# EAGLE design arduino_wireless_shield_rev_1_0 (EAGLE 6.3)
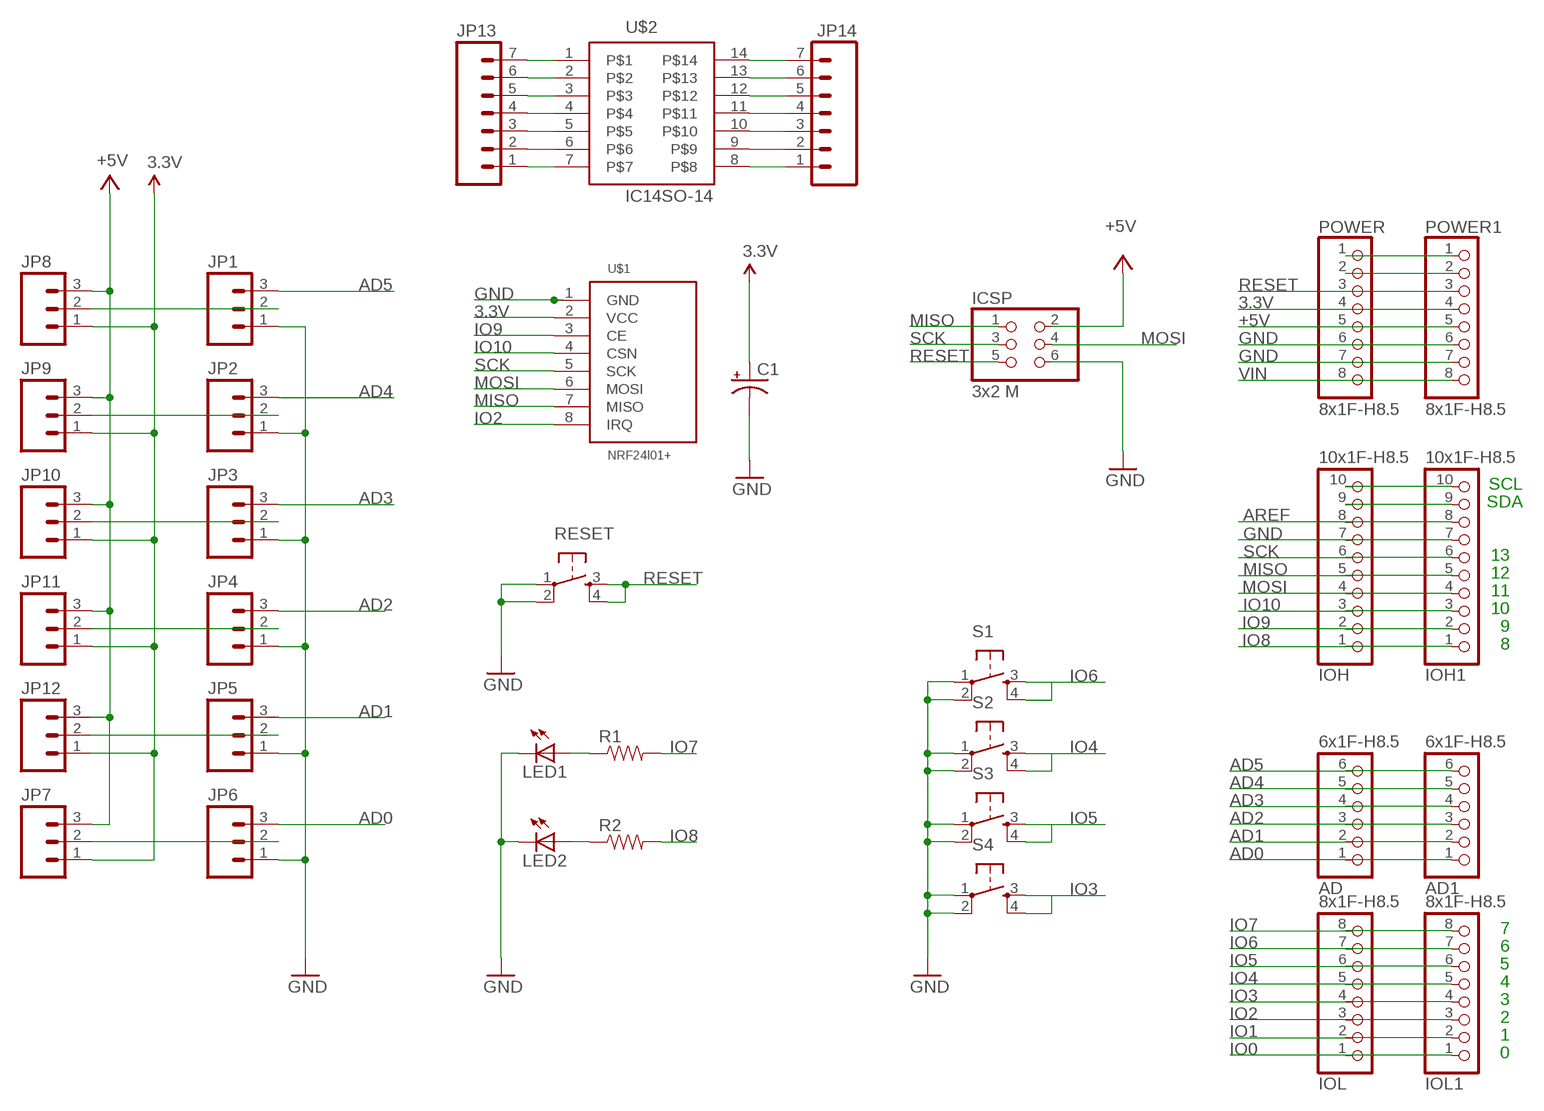
[diagram p0: schematic, sheet 1]

## Parts
AD  6x1F-H8.5  PINHD-1X6  [1X06]
AD1  6x1F-H8.5  PINHD-1X6  [1X06]
C1  CPOL-USTT2D7  [TT2D7]
ICSP  3x2 M  PINHD-2X3  [2X03]
IOH  10x1F-H8.5  PINHD-1X10_ARD  [1X10]
IOH1  10x1F-H8.5  PINHD-1X10_ARD  [1X10]
IOL  8x1F-H8.5  PINHD-1X8  [1X08]
IOL1  8x1F-H8.5  PINHD-1X8  [1X08]
JP1  M03PTH  [1X03]
JP2  M03PTH  [1X03]
JP3  M03PTH  [1X03]
JP4  M03PTH  [1X03]
JP5  M03PTH  [1X03]
JP6  M03PTH  [1X03]
JP7  M03PTH  [1X03]
JP8  M03PTH  [1X03]
JP9  M03PTH  [1X03]
JP10  M03PTH  [1X03]
JP11  M03PTH  [1X03]
JP12  M03PTH  [1X03]
JP13  M07  [1X07]
JP14  M07  [1X07]
LED1  LED5MM  [LED5MM]
LED2  LED5MM  [LED5MM]
POWER  8x1F-H8.5  PINHD-1X8  [1X08]
POWER1  8x1F-H8.5  PINHD-1X8  [1X08]
R1  RESISTORPTH-1/4W  [AXIAL-0.4]
R2  RESISTORPTH-1/4W  [AXIAL-0.4]
RESET  TAC_SWITCHPTH  [TACTILE-PTH]
S1  TAC_SWITCHPTH  [TACTILE-PTH]
S2  TAC_SWITCHPTH  [TACTILE-PTH]
S3  TAC_SWITCHPTH  [TACTILE-PTH]
S4  TAC_SWITCHPTH  [TACTILE-PTH]
U$1  NRF24L01+_MODULE  [NRF24L01+MODULE]
U$2  IC14SO-14  [SO14]

## Nets
3.3V [power]: C1.+ JP7.1 JP8.1 JP9.1 JP10.1 JP11.1 JP12.1 POWER1.4 POWER.4 U$1.2(VCC)
+5V [usbvcc]: ICSP.2 JP7.3 JP8.3 JP9.3 JP10.3 JP11.3 JP12.3 POWER1.5 POWER.5
AD0: AD1.1 AD.1 JP6.3
AD1: AD1.2 AD.2 JP5.3
AD2: AD1.3 AD.3 JP4.3
AD3: AD1.4 AD.4 JP3.3
AD4: AD1.5 AD.5 JP2.3
AD5: AD1.6 AD.6 JP1.3
AREF [aref]: IOH1.8 IOH.8
GND [gnd]: C1.- ICSP.6 IOH1.7 IOH.7 JP1.1 JP2.1 JP3.1 JP4.1 JP5.1 JP6.1 LED1.K(C) LED2.K(C) POWER1.6 POWER1.7 POWER.6 POWER.7 RESET.1 RESET.2 S1.1 S1.2 S2.1 S2.2 S3.1 S3.2 S4.1 S4.2 U$1.1(GND)
IO0: IOL1.1 IOL.1
IO1: IOL1.2 IOL.2
IO2: IOL1.3 IOL.3 U$1.8(IRQ)
IO3: IOL1.4 IOL.4 S4.3 S4.4
IO4: IOL1.5 IOL.5 S2.3 S2.4
IO5: IOL1.6 IOL.6 S3.3 S3.4
IO6: IOL1.7 IOL.7 S1.3 S1.4
IO7: IOL1.8 IOL.8 R1.P$2
IO8: IOH1.1 IOH.1 R2.P$2
IO9: IOH1.2 IOH.2 U$1.3(CE)
IO10: IOH1.3 IOH.3 U$1.4(CSN)
MISO: ICSP.1 IOH1.5 IOH.5 U$1.7(MISO)
MOSI: ICSP.4 IOH1.4 IOH.4 U$1.6(MOSI)
N$1: POWER1.1 POWER.1
N$2: POWER1.2 POWER.2
N$3: JP13.7 U$2.1
N$4: JP6.2 JP7.2
N$5: LED2.A R2.P$1
N$6: LED1.A R1.P$1
N$7: IOH1.10 IOH.10
N$8: IOH1.9 IOH.9
N$9: JP13.6 U$2.2
N$10: JP5.2 JP12.2
N$11: JP4.2 JP11.2
N$12: JP3.2 JP10.2
N$13: JP2.2 JP9.2
N$14: JP1.2 JP8.2
N$15: JP13.5 U$2.3
N$16: JP13.4 U$2.4
N$17: JP13.3 U$2.5
N$18: JP13.2 U$2.6
N$19: JP13.1 U$2.7
N$20: JP14.7 U$2.14
N$21: JP14.6 U$2.13
N$22: JP14.5 U$2.12
N$23: JP14.4 U$2.11
N$24: JP14.3 U$2.10
N$25: JP14.2 U$2.9
N$26: JP14.1 U$2.8
RESET: ICSP.5 POWER1.3 POWER.3 RESET.3 RESET.4
SCK: ICSP.3 IOH1.6 IOH.6 U$1.5(SCK)
VIN [power]: POWER1.8 POWER.8

## Notes on the sheet
- SCL
- SDA
- 13
- 12
- 11
- 10
- 9
- 8
- 7
- 6
- 5
- 4
- 3
- 2
- 1
- 0

## Library data of the parts
AD AD1 = SmartPrj:PINHD-1X6: PIN HEADER
C1 = rcl:CPOL-US: POLARIZED CAPACITOR, American symbol
ICSP = SmartPrj:PINHD-2X3: PIN HEADER
IOH IOH1 = SmartPrj:PINHD-1X10_ARD: PIN HEADER
IOL IOL1 POWER POWER1 = SmartPrj:PINHD-1X8: PIN HEADER
JP1-JP12 = SparkFun-Connectors:M03: Header 3 Standard 3-pin 0.1" header. Use with straight break away headers (SKU : PRT-00116), right angle break away headers (PRT-00553), swiss pins (PRT-00743), machine pins (PRT-00117), and female headers (PRT-00115). Molex polarized connector foot print use with SKU : PRT-08232 with associated crimp pins and housings.
JP13 JP14 = SparkFun-Connectors:M07: Header 7 Standard 7-pin 0.1" header. Use with straight break away headers (SKU : PRT-00116), right angle break away headers (PRT-00553), swiss pins (PRT-00743), machine pins (PRT-00117), and female headers (PRT-00115). NOTES ON THE VARIANTS LOCK and LOCK_LONGPADS... This footprint was designed to help hold the alignment of a through-hole component (i.e. 7-pin header) while soldering it into place. You may notice that each hole has been shifted either up or down by 0.005 of an inch from it's more standard position (which is usually a perfectly straight line). This slight alteration caused the pins (the squares in the middle) to touch the edges of the holes. Because they are alternating, it causes a "brace" to hold the header in place. 0.005 has proven to be the perfect amount of "off-center" position when using our standard breakaway headers. Although looks a little odd when you look at the bare footprint, once you have a header in there, the alteration is very hard to notice. Also, if you push a header all the way into place, it is covered up entirely on the bottom side. This idea of altering the position of holes to aid alignment will be further integrated into the Sparkfun Library for other footprints. It can help hold any component with 3 or more connection pins.
LED1 LED2 = SparkFun-LED:LED: LEDs Standard schematic elements and footprints for 5mm, 3mm, 1206, and 0603 sized LEDs. 5mm - Spark Fun Electronics SKU : COM-00529 (and others)
R1 R2 = SparkFun-Resistors:RESISTOR: Resistor Basic schematic elements and footprints for 0603, 1206, and PTH resistors.
RESET S1-S4 = buttons:TAC_SWITCH: Momentary Switch Button commonly used for reset or general input. Spark Fun Electronics SKU : COM-00097 SMT- SWCH-08247
U$1 = nrf24l01:NRF24L01+_MODULE
U$2 = packages:IC14

## Net classes
0 default: width 0.254 mm, clearance 0.254 mm
1 power: width 0.61 mm, drill 0.61 mm, clearance 0.254 mm
2 gnd: width 0.305 mm, drill 0.559 mm, clearance 0.254 mm
3 usbvcc: width 0.508 mm, drill 0.61 mm, clearance 0.254 mm
4 aref: width 0.406 mm, drill 0.61 mm, clearance 0.254 mm

## Board
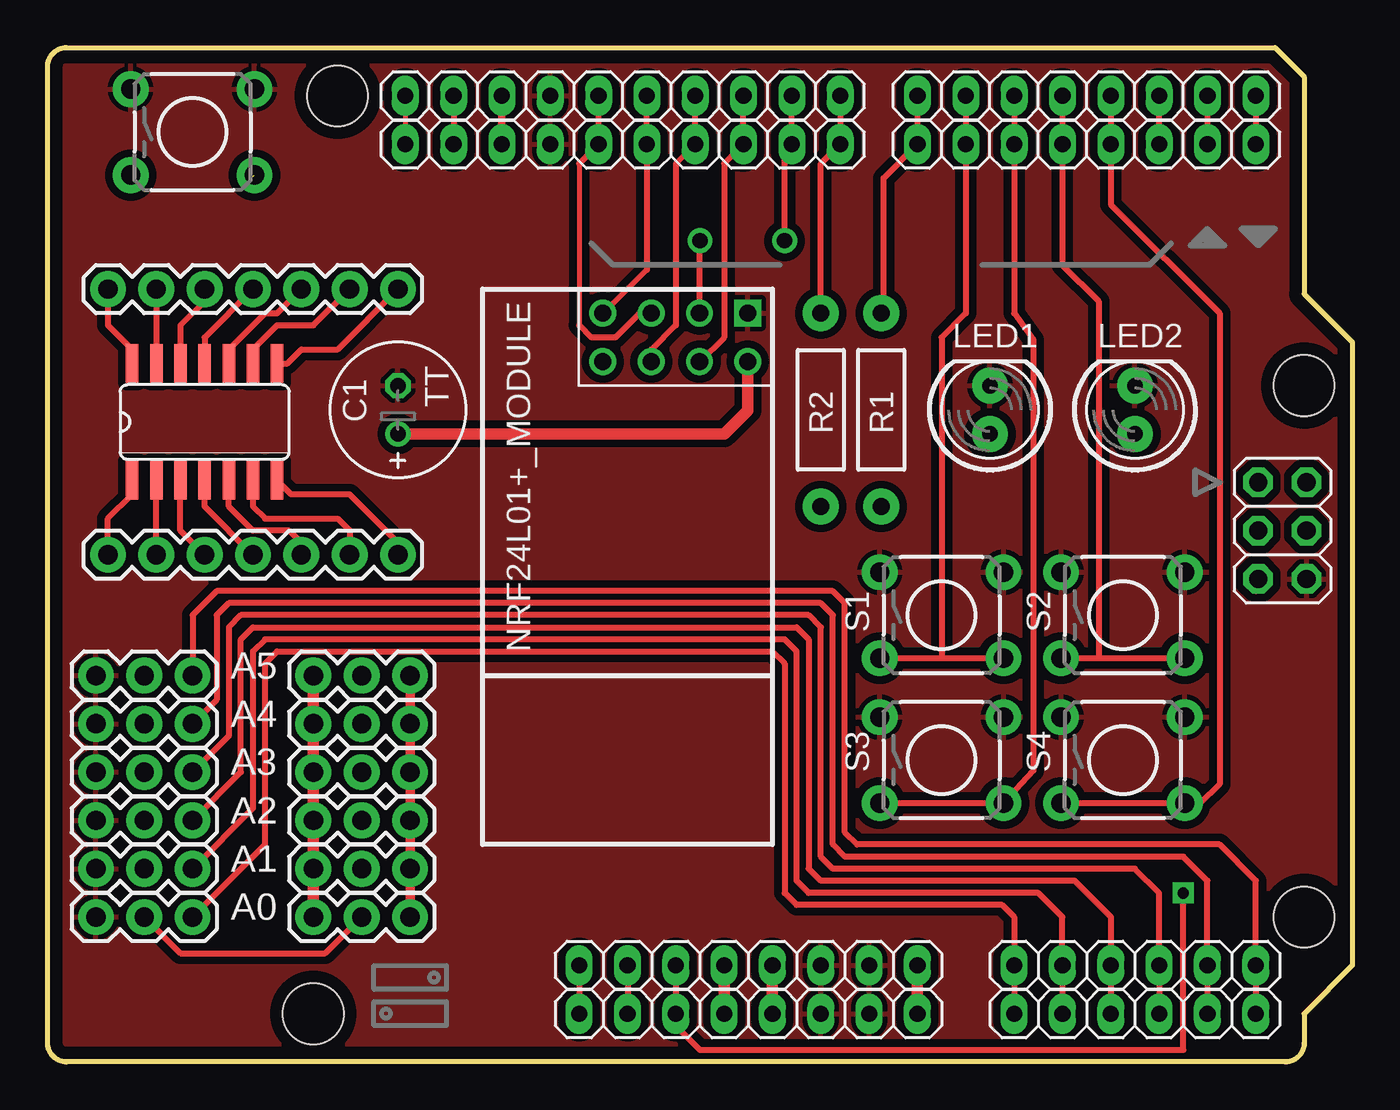
[diagram p1: board, top side]
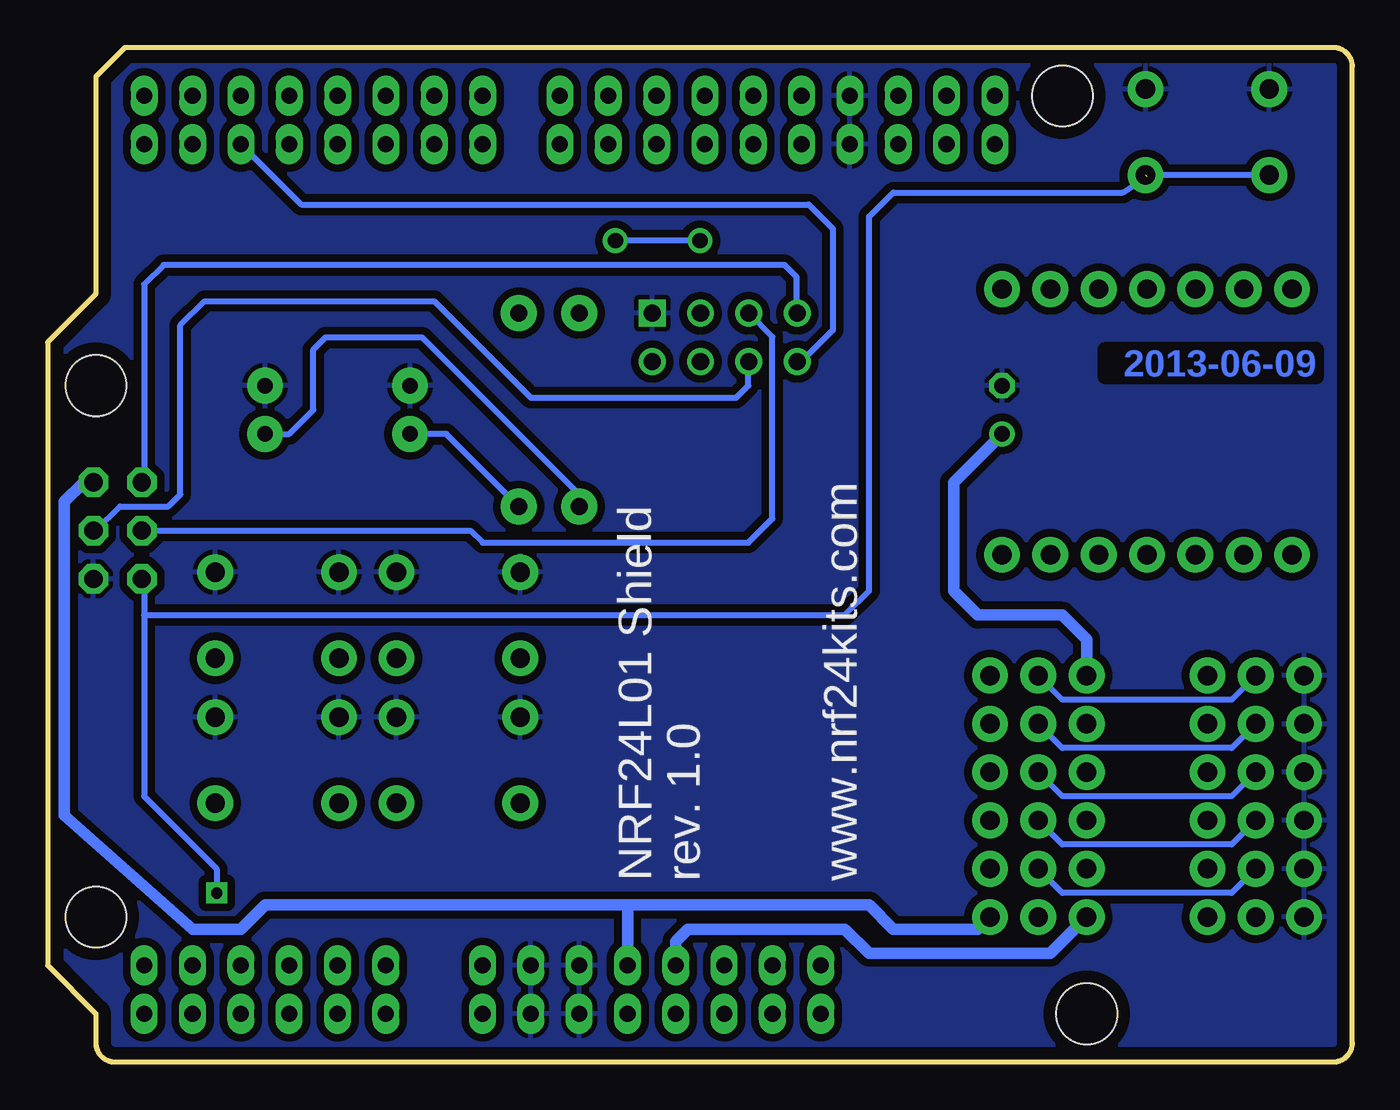
[diagram p2: board, bottom side, seen from below]

Size 68.58 x 53.34 mm. Coordinates in mm from the lower left corner, seen from the top.
Outline: 64.52,53.34 66.04,51.82 66.04,40.39 68.58,37.85 68.58,5.08 66.04,2.54 66.04,1 arc-90 65.04,0 1,0 arc-90 0,1 0,52.34 arc-90 1,53.34 64.52,53.34
Copper layers (1*16): Top 0.035mm / dielectric 1.5mm / Bottom 0.035mm
Design rules "default *": minimum track width 10mil, minimum drill 22mil, track to track 10mil, track to pad 10mil, pad to pad 10mil, via to via 12mil, smd to smd 8mil, copper to edge 26mil, drill to drill 12mil, minimum pad ring 10mil, minimum via ring 10mil, stop-mask expansion 1mil, vias tented up to drill 30mil, thermal gap 10mil
Holes 3.2 mm at 66.04,35.56 66.04,7.62 15.24,50.8 13.97,2.54

### Footprints (pad centres in the part's own frame; a part is rotated, then mirrored left to right if it is on the bottom)
1X06 = drill 0.85 pad 1.422 long: 1 -6.35,0; 2 -3.81,0; 3 -1.27,0; 4 1.27,0; 5 3.81,0; 6 6.35,0
TT2D7 = drill 0.813: + -1.27,0 | drill 0.813 octagon: - 1.27,0
2X03 = drill 0.95 pad 1.55 octagon: 1 -2.54,-1.27; 2 -2.54,1.27; 3 0,-1.27; 4 0,1.27; 5 2.54,-1.27; 6 2.54,1.27
1X10@1 = drill 0.85 pad 1.422 long: 1 -11.43,0; 2 -8.89,0; 3 -6.35,0; 4 -3.81,0; 5 -1.27,0; 6 1.27,0; 7 3.81,0; 8 6.35,0; 9 8.89,0; 10 11.43,0
1X10 = drill 0.85 pad 1.422 long: 1 -11.43,0; 2 -8.89,0; 3 -6.35,0; 4 -3.81,0; 5 -1.27,0; 6 1.27,0; 7 3.81,0; 8 6.35,0; 9 8.89,0; 10 11.43,0
1X08 = drill 0.85 pad 1.422 long: 1 -8.89,0; 2 -6.35,0; 3 -3.81,0; 4 -1.27,0; 5 1.27,0; 6 3.81,0; 7 6.35,0; 8 8.89,0
1X03 = drill 1.016 pad 1.88: 1 0,0; 2 2.54,0; 3 5.08,0
1X07 = drill 1.016 pad 1.88: 1 0,0; 2 2.54,0; 3 5.08,0; 4 7.62,0; 5 10.16,0; 6 12.7,0; 7 15.24,0
LED5MM = drill 0.813 pad 1.88: A -1.27,0; K 1.27,0
AXIAL-0.4 = drill 0.9 pad 1.88: P$1 -5.08,0; P$2 5.08,0
TACTILE-PTH = drill 1.016 pad 1.88: 1 -3.251,2.261; 2 3.251,2.261; 3 -3.251,-2.261; 4 3.251,-2.261
NRF24L01+MODULE = drill 0.9 square: 1 -1.27,3.81 | drill 0.9: 2 1.27,3.81; 3 -1.27,1.27; 4 1.27,1.27; 5 -1.27,-1.27; 6 1.27,-1.27; 7 -1.27,-3.81; 8 1.27,-3.81
SO14 = smd 0.66 x 2.032: 1 -3.81,-3.073; 2 -2.54,-3.073; 3 -1.27,-3.073; 4 0,-3.073; 5 1.27,-3.073; 6 2.54,-3.073; 7 3.81,-3.073; 8 3.81,3.073; 9 2.54,3.073; 10 1.27,3.073; 11 0,3.073; 12 -1.27,3.073; 13 -2.54,3.073; 14 -3.81,3.073

### Placement (x,y rotation side)
AD  57.15,2.54 0 top
AD1  57.15,5.08 0 top
C1  18.41,34.29 90 top
ICSP  64.9,27.94 270 top
IOH  10x1F-H8.5  [1X10@1]  30.23,50.8 180 top
IOH1  30.23,48.26 180 top
IOL  54.61,50.8 180 top
IOL1  54.61,48.26 180 top
JP1  2.54,20.32 0 top
JP2  2.54,17.78 0 top
JP3  2.54,15.24 0 top
JP4  2.54,12.7 0 top
JP5  2.54,10.16 0 top
JP6  2.54,7.62 0 top
JP7  13.97,7.62 0 top
JP8  13.97,20.32 0 top
JP9  13.97,17.78 0 top
JP10  13.97,15.24 0 top
JP11  13.97,12.7 0 top
JP12  13.97,10.16 0 top
JP13  18.41,26.67 180 top
JP14  18.41,40.64 180 top
LED1  49.53,34.29 90 top
LED2  57.15,34.29 90 top
POWER  36.83,2.54 0 top
POWER1  36.83,5.08 0 top
R1  43.81,34.29 90 top
R2  40.64,34.29 90 top
RESET  7.62,48.9 0 top
S1  46.99,23.5 0 top
S2  56.52,23.5 0 top
S3  46.99,15.88 0 top
S4  56.52,15.88 0 top
U$1  32.99,38.1 270 top
U$2  8.26,33.66 0 top

### Tracks (layer width: path | path; a pad name or v marks a point on that pad's centre or on a via)
3.3V
  Top 0.61: JP7.1 JP12.1 JP11.1 JP10.1 JP9.1 JP8.1 | POWER.4 POWER1.4 35.56,5.33 | U$1.2 36.8,34.27 35.56,33.02 C1.+
  Bottom 0.61: JP8.1 13.97,22.23 15.24,23.5 19.68,23.5 20.95,24.77 20.95,30.48 C1.+ | JP7.1 15.88,5.71 25.4,5.71 26.67,6.99 34.92,6.99 35.56,6.35 POWER1.4
+5V
  Top 0.508: JP8.3 JP9.3 JP10.3 JP11.3 JP12.3 JP7.3
  Top 0.61: POWER1.5 POWER.5
  Bottom 0.61: ICSP.2 66.67,30.48 67.69,29.46 67.69,12.95 60.96,6.99 58.42,6.99 57.15,8.26 38.1,8.26 | POWER1.5 38.1,8.26 | 38.1,8.26 25.4,8.26 24.13,6.99 19.68,6.99 JP7.3
AD0
  Top 0.305: AD.1 AD1.1 50.8,7.62 50.16,8.26 39.37,8.26 38.73,8.89 38.73,20.95 38.1,21.59 12.06,21.59 11.43,20.95 11.43,11.43 JP6.3
AD1
  Top 0.305: AD.2 AD1.2 53.34,7.62 52.07,8.89 40.01,8.89 39.37,9.53 39.37,21.59 38.73,22.23 11.43,22.23 10.79,21.59 10.79,13.34 JP5.3
AD2
  Top 0.305: AD.3 AD1.3 55.88,7.62 53.98,9.53 40.64,9.53 40.01,10.16 40.01,22.23 39.37,22.86 10.79,22.86 10.16,22.23 10.16,15.24 JP4.3
AD3
  Top 0.305: AD.4 AD1.4 58.42,8.89 57.15,10.16 41.27,10.16 40.64,10.79 40.64,22.86 40.01,23.5 10.16,23.5 9.53,22.86 9.53,17.14 JP3.3
AD4
  Top 0.305: AD.5 AD1.5 60.96,9.53 59.69,10.79 41.91,10.79 41.27,11.43 41.27,23.5 40.64,24.13 9.53,24.13 8.89,23.5 8.89,19.05 JP2.3
AD5
  Top 0.305: AD.6 AD1.6 63.5,9.53 61.59,11.43 42.55,11.43 41.91,12.06 41.91,24.13 41.27,24.77 8.89,24.77 7.62,23.5 JP1.3
AREF
  Top 0.406: IOH.8 IOH1.8
GND
  pour Bottom (isolate 0.406, rank 2): 0,52.7 67.69,52.7 67.94,52.45 67.94,0.64 0.25,0.64 0,0.89
  pour Top (isolate 0.406, rank 2): 0.51,52.7 67.94,52.7 67.94,0.64 0,0.64 -0.13,30.48
IO0
  Top 0.305: IOL.1 IOL1.1
IO1
  Top 0.305: IOL.2 IOL1.2
IO2
  Top 0.305: IOL1.3 IOL.3
  Bottom 0.254: 28.96,36.83 U$1.8
  Bottom 0.305: 28.96,36.83 27.3,38.48 27.3,43.81 28.57,45.09 55.24,45.09 IOL1.3
IO3
  Top 0.305: IOL.4 IOL1.4 55.88,45.09 61.59,39.37 61.59,14.61 60.6,13.61 S4.4 S4.3
IO4
  Top 0.305: IOL.5 IOL1.5 53.34,41.91 55.24,40.01 55.24,21.23 | S2.3 55.24,21.23 | 55.24,21.23 S2.4
IO5
  Top 0.305: IOL.6 IOL1.6 50.8,39.37 51.82,37.97 51.82,15.32 S3.4 S3.3
IO6
  Top 0.305: IOL.7 IOL1.7 48.26,39.37 46.99,38.1 46.99,21.23 | S1.3 46.99,21.23 | 46.99,21.23 S1.4
IO7
  Top 0.254: 43.94,39.37 R1.P$2
  Top 0.305: IOL.8 IOL1.8 43.94,46.48 43.94,39.37
IO8
  Top 0.305: IOH.1 IOH1.1 40.64,47.24 R2.P$2
IO9  (via drill 0.8)
  Top 0.305: IOH.2 IOH1.2 38.73,47.88 v38.73,43.18 | U$1.3 34.27,43.16 v34.29,43.18
  Bottom 0.305: v34.29,43.18 v38.73,43.18
IO10
  Top 0.254: 34.29,36.83 U$1.4
  Top 0.305: 34.29,36.83 35.56,38.1 35.56,47.24 IOH1.3 IOH.3
MISO
  Top 0.254: 31.5,41.66 29.21,39.37 U$1.7
  Top 0.305: 31.5,41.66 IOH1.5 IOH.5
  Bottom 0.254: 63.5,30.48 ICSP.1 | 29.21,39.37 U$1.7
  Bottom 0.305: 63.5,30.48 63.5,40.89 62.48,41.91 29.84,41.91 29.21,41.27 29.21,39.37
MOSI
  Top 0.254: IOH1.4 33.02,47.24 | 31.75,36.83 U$1.6
  Top 0.305: 33.02,47.24 33.02,38.73 31.75,37.47 31.75,36.85 U$1.6 | IOH1.4 IOH.4
  Bottom 0.305: ICSP.4 66.04,27.94 64.77,29.21 62.23,29.21 61.59,29.84 61.59,38.73 60.33,40.01 48.26,40.01 43.18,34.92 32.38,34.92 31.75,35.56 31.75,36.8 U$1.6
N$1
  Top 0.305: POWER1.1 POWER.1
N$2
  Top 0.305: POWER1.2 POWER.2
N$3
  Top 0.305: JP13.7 3.17,28.57 4.45,29.84 U$2.1
N$4
  Top 0.305: JP6.2 6.99,5.71 14.61,5.71 JP7.2
N$5
  Bottom 0.305: LED2.A 55.88,33.02 54.61,34.29 54.61,37.47 53.98,38.1 48.9,38.1 40.64,29.84 R2.P$1
N$6
  Bottom 0.305: R1.P$1 47.62,33.02 LED1.A
N$7
  Top 0.254: IOH.10 IOH1.10
N$8
  Top 0.305: IOH.9 IOH1.9
N$9
  Top 0.305: JP13.6 U$2.2
N$10
  Bottom 0.305: JP5.2 6.35,8.89 15.24,8.89 JP12.2
N$11
  Bottom 0.305: JP4.2 6.35,11.43 15.24,11.43 JP11.2
N$12
  Bottom 0.305: JP3.2 6.35,13.97 15.24,13.97 JP10.2
N$13
  Bottom 0.305: JP2.2 6.35,16.51 15.24,16.51 JP9.2
N$14
  Bottom 0.305: JP1.2 6.35,19.05 15.24,19.05 JP8.2
N$15
  Top 0.305: JP13.5 6.99,27.94 U$2.3
N$16
  Top 0.305: JP13.4 8.26,29.21 U$2.4
N$17
  Top 0.305: JP13.3 13.34,27.3 12.7,27.94 10.79,27.94 9.53,29.21 U$2.5
N$18
  Top 0.305: U$2.6 10.79,29.21 11.43,28.57 15.24,28.57 15.88,27.94 JP13.2
N$19
  Top 0.305: JP13.1 18.41,27.3 15.88,29.84 12.8,29.84 U$2.7
N$20
  Top 0.305: JP14.7 3.17,38.73 4.45,37.47 U$2.14
N$21
  Top 0.305: JP14.6 U$2.13
N$22
  Top 0.305: JP14.5 8.26,40.01 6.99,38.73 U$2.12
N$23
  Top 0.305: JP14.4 8.26,38.1 U$2.11
N$24
  Top 0.305: U$2.10 9.53,37.47 11.43,39.37 12.06,39.37 JP14.3
N$25
  Top 0.305: U$2.9 10.79,37.47 12.06,38.73 13.97,38.73 JP14.2
N$26
  Top 0.305: U$2.8 12.6,36.73 13.34,37.47 15.24,37.47 JP14.1
RESET  (via drill 0.6)  (1 unrouted)
  Top 0.254: POWER1.3 POWER.3
  Top 0.305: POWER1.3 33.02,1.91 34.29,0.64 59.69,0.64 v59.69,8.89 | 63.5,24.77 63.18,25.08 63.31,25.08 ICSP.5
  Bottom 0.305: ICSP.5 63.5,25.4 63.5,23.5 | 63.5,23.5 26.67,23.5 25.4,24.77 25.4,44.45 24.13,45.72 12.06,45.72 10.79,46.56 | 63.5,23.5 63.5,13.97 59.69,10.16 v59.69,8.89 | RESET.3 RESET.4
SCK
  Top 0.254: 27.94,47.24 27.94,38.73
  Top 0.305: 27.94,47.24 IOH1.6 IOH.6 | U$1.5 31.11,39.37 29.84,38.1 28.57,38.1 27.94,38.73
  Bottom 0.254: 63.5,27.94 ICSP.3
  Bottom 0.305: U$1.5 30.48,38.12 30.48,28.57 31.75,27.3 45.72,27.3 46.35,27.94 63.5,27.94
VIN
  Top 0.61: POWER1.8 POWER.8

### Text on the board
Bottom: 2013-06-09
tNames: A5 | A4 | A3 | A2 | A1 | A0
bNames: www.nrf24kits.com | rev. 1.0 | NRF24L01 Shield
tDocu: SCL | SDA | AREF | GND | 13 | 12 | 11 | 10 | 9 | 8 | 7 | 6 | 5 | 4 | 3 | 2 | 1 | 0 | DIGITAL | TX | RX | Voltage selectors | IOREF | RESET | 3V3 | 5V | GND | GND | VIN | A0 | A1 | A2 | A3 | A4 | A5 | GND | VCC | D | +3.3V | +5V
tPlace1: www.arduino.cc